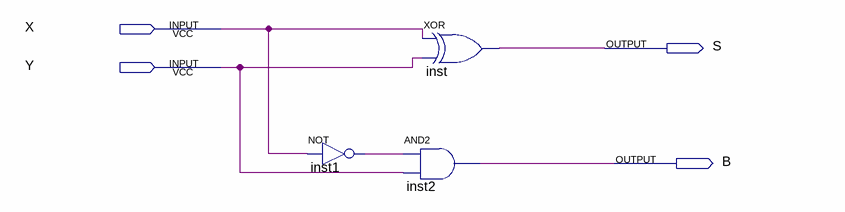
[diagram p0: schematic sheet]
// Quartus schematic Meio_Subtrador.bdf as structural Verilog: 3 symbols, 4 pins
module Meio_Subtrador (
  input  X,
  input  Y,
  output S,
  output B
);

  wire inst1_out;

  not inst1 (inst1_out, X);
  xor inst (S, X, Y);
  and inst2 (B, inst1_out, Y);
endmodule
